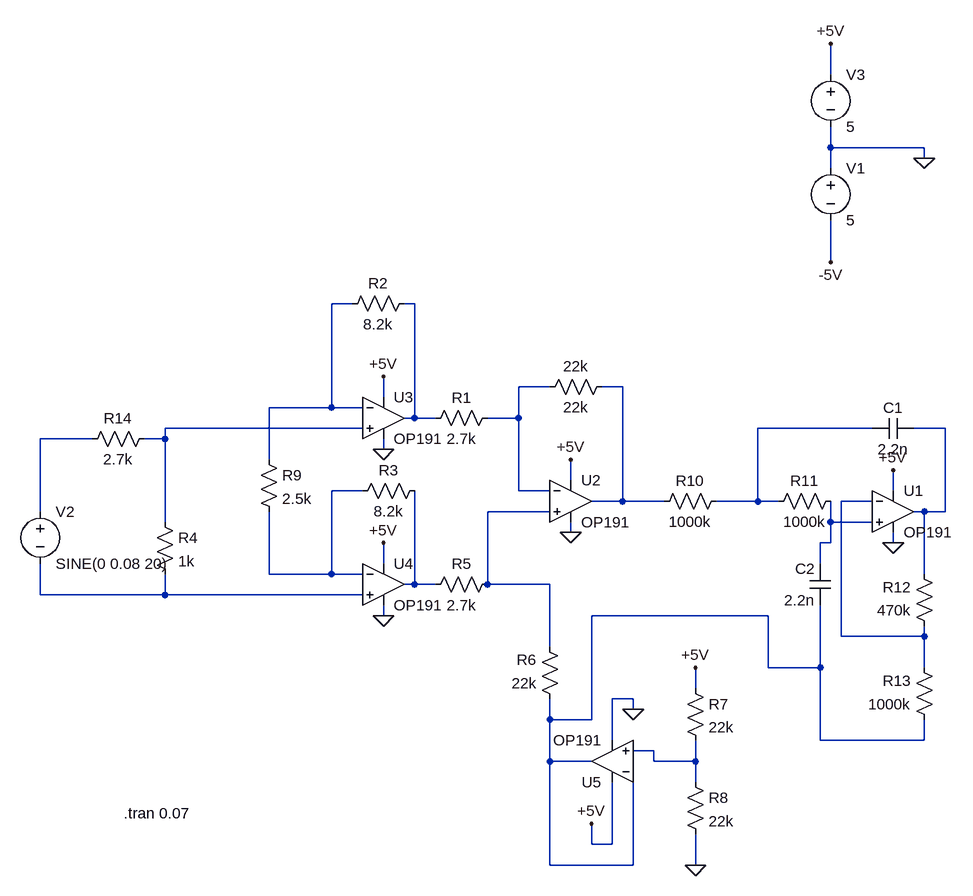
[diagram p0: schematic instrumentation amplifier.asc]
instrumentation amplifier.asc, the LTspice schematic file:
Version 4
SHEET 1 1880 836
WIRE 928 -400 928 -448
WIRE 928 -288 928 -320
WIRE 1072 -288 928 -288
WIRE 1072 -272 1072 -288
WIRE 928 -256 928 -288
WIRE 928 -112 928 -176
WIRE 192 -48 160 -48
WIRE 288 -48 272 -48
WIRE 496 80 448 80
WIRE 608 80 576 80
WIRE 240 96 240 64
WIRE 160 112 160 -48
WIRE 160 112 64 112
WIRE 208 112 160 112
WIRE 288 128 288 -48
WIRE 288 128 272 128
WIRE 320 128 288 128
WIRE 448 128 448 80
WIRE 448 128 400 128
WIRE 208 144 -96 144
WIRE 992 144 816 144
WIRE 1104 144 1056 144
WIRE -208 160 -288 160
WIRE -96 160 -96 144
WIRE -96 160 -128 160
WIRE 240 176 240 160
WIRE 64 192 64 112
WIRE 528 224 528 192
WIRE 208 240 160 240
WIRE 448 240 448 128
WIRE 496 240 448 240
WIRE 1024 240 1024 208
WIRE 608 256 608 80
WIRE 608 256 560 256
WIRE 672 256 608 256
WIRE 816 256 816 144
WIRE 816 256 752 256
WIRE 848 256 816 256
WIRE 992 256 944 256
WIRE -288 272 -288 160
WIRE 496 272 400 272
WIRE 1072 272 1056 272
WIRE 1104 272 1104 144
WIRE 1104 272 1072 272
WIRE -96 288 -96 160
WIRE 928 288 928 256
WIRE 992 288 928 288
WIRE 528 304 528 288
WIRE 928 320 928 288
WIRE 928 320 912 320
WIRE 1024 320 1024 304
WIRE 240 352 240 320
WIRE 912 352 912 320
WIRE 64 368 64 272
WIRE 160 368 160 240
WIRE 160 368 64 368
WIRE 208 368 160 368
WIRE 1072 368 1072 272
WIRE 288 384 288 240
WIRE 288 384 272 384
WIRE 320 384 288 384
WIRE 400 384 400 272
WIRE 496 384 400 384
WIRE -288 400 -288 352
WIRE -96 400 -96 368
WIRE -96 400 -288 400
WIRE 208 400 -96 400
WIRE 240 432 240 416
WIRE 832 432 560 432
WIRE 944 464 944 256
WIRE 1072 464 1072 448
WIRE 1072 464 944 464
WIRE 496 480 496 384
WIRE 832 512 832 432
WIRE 912 512 912 416
WIRE 912 512 832 512
WIRE 1072 512 1072 464
WIRE 720 544 720 512
WIRE 624 560 592 560
WIRE 624 576 624 560
WIRE 496 592 496 560
WIRE 560 592 560 432
WIRE 560 592 496 592
WIRE 592 624 592 560
WIRE 912 624 912 512
WIRE 1072 624 1072 592
WIRE 1072 624 912 624
WIRE 656 640 624 640
WIRE 496 656 496 592
WIRE 560 656 496 656
WIRE 656 656 656 640
WIRE 720 656 720 624
WIRE 720 656 656 656
WIRE 720 688 720 656
WIRE 560 784 560 752
WIRE 592 784 592 688
WIRE 592 784 560 784
WIRE 496 816 496 656
WIRE 624 816 624 672
WIRE 624 816 496 816
WIRE 720 816 720 768
FLAG 528 192 +5V
FLAG 240 64 +5V
FLAG 240 320 +5V
FLAG 1024 208 +5V
FLAG 928 -112 -5V
FLAG 928 -448 +5V
FLAG 1072 -272 0
FLAG 720 816 0
FLAG 624 576 0
FLAG 720 512 +5V
FLAG 560 752 +5V
FLAG 240 176 0
FLAG 240 432 0
FLAG 528 304 0
FLAG 1024 320 0
SYMBOL voltage 928 -272 R0
WINDOW 123 0 0 Left 0
WINDOW 39 0 0 Left 0
SYMATTR InstName V1
SYMATTR Value 5
SYMBOL res 416 112 R90
WINDOW 0 0 56 VBottom 2
WINDOW 3 32 56 VTop 2
SYMATTR InstName R1
SYMATTR Value 2.7k
SYMBOL res 288 -64 R90
WINDOW 0 0 56 VBottom 2
WINDOW 3 32 56 VTop 2
SYMATTR InstName R2
SYMATTR Value 8.2k
SYMBOL res 304 224 R90
WINDOW 0 0 56 VBottom 2
WINDOW 3 32 56 VTop 2
SYMATTR InstName R3
SYMATTR Value 8.2k
SYMBOL res 592 64 R90
WINDOW 0 0 56 VBottom 2
WINDOW 3 32 56 VTop 2
SYMATTR InstName 22k
SYMATTR Value 22k
SYMBOL res 416 368 R90
WINDOW 0 0 56 VBottom 2
WINDOW 3 32 56 VTop 2
SYMATTR InstName R5
SYMATTR Value 2.7k
SYMBOL res 512 576 R180
WINDOW 0 36 76 Left 2
WINDOW 3 36 40 Left 2
SYMATTR InstName R6
SYMATTR Value 22k
SYMBOL res 768 240 R90
WINDOW 0 0 56 VBottom 2
WINDOW 3 32 56 VTop 2
SYMATTR InstName R10
SYMATTR Value 1000k
SYMBOL res 944 240 R90
WINDOW 0 0 56 VBottom 2
WINDOW 3 32 56 VTop 2
SYMATTR InstName R11
SYMATTR Value 1000k
SYMBOL res 1088 464 R180
WINDOW 0 36 76 Left 2
WINDOW 3 36 40 Left 2
SYMATTR InstName R12
SYMATTR Value 470k
SYMBOL res 1088 608 R180
WINDOW 0 36 76 Left 2
WINDOW 3 36 40 Left 2
SYMATTR InstName R13
SYMATTR Value 1000k
SYMBOL cap 1056 128 R90
WINDOW 0 0 32 VBottom 2
WINDOW 3 32 32 VTop 2
SYMATTR InstName C1
SYMATTR Value 2.2n
SYMBOL cap 928 416 R180
WINDOW 0 24 56 Left 2
WINDOW 3 24 8 Left 2
SYMATTR InstName C2
SYMATTR Value 2.2n
SYMBOL res -112 272 R0
SYMATTR InstName R4
SYMATTR Value 1k
SYMBOL res -112 144 R90
WINDOW 0 0 56 VBottom 2
WINDOW 3 32 56 VTop 2
SYMATTR InstName R14
SYMATTR Value 2.7k
SYMBOL voltage -288 256 R0
WINDOW 123 0 0 Left 0
WINDOW 39 0 0 Left 0
SYMATTR InstName V2
SYMATTR Value SINE(0 0.08 20)
SYMBOL res 48 176 R0
SYMATTR InstName R9
SYMATTR Value 2.5k
SYMBOL voltage 928 -416 R0
WINDOW 123 0 0 Left 0
WINDOW 39 0 0 Left 0
SYMATTR InstName V3
SYMATTR Value 5
SYMBOL res 704 528 R0
SYMATTR InstName R7
SYMATTR Value 22k
SYMBOL res 704 672 R0
SYMATTR InstName R8
SYMATTR Value 22k
SYMBOL OpAmps\\OP191 1024 208 R0
SYMATTR InstName U1
SYMBOL OpAmps\\OP191 528 192 R0
SYMATTR InstName U2
SYMBOL OpAmps\\OP191 240 64 R0
SYMATTR InstName U3
SYMBOL OpAmps\\OP191 240 320 R0
SYMATTR InstName U4
SYMBOL OpAmps\\OP191 592 720 R180
SYMATTR InstName U5
TEXT -160 736 Left 2 !.tran 0.07

The netlist it stands for:
* instrumentation amplifier.asc
V1 0 -5V 5
R1 N003 N002 2.7k
R2 N002 N001 8.2k
R3 N013 N009 8.2k
R§22k N004 N003 22k
R5 N011 N013 2.7k
R6 N015 N011 22k
R10 N006 N004 1000k
R11 N012 N006 1000k
R12 N010 N007 470k
R13 N015 N010 1000k
C1 N007 N006 2.2n
C2 N015 N012 2.2n
R4 N005 N014 1k
R14 N005 N008 2.7k
V2 N008 N014 SINE(0 0.08 20)
R9 N001 N009 2.5k
V3 +5V 0 5
R7 +5V N016 22k
R8 N016 0 22k
XU1 N012 N010 +5V 0 N007 OP191  ; pins In+ In- V+ V- OUT
XU2 N011 N003 +5V 0 N004 OP191  ; pins In+ In- V+ V- OUT
XU3 N005 N001 +5V 0 N002 OP191  ; pins In+ In- V+ V- OUT
XU4 N014 N009 +5V 0 N013 OP191  ; pins In+ In- V+ V- OUT
XU5 N016 N015 +5V 0 N015 OP191  ; pins In+ In- V+ V- OUT
.tran 0.07
.lib ADI.lib
.backanno
.end